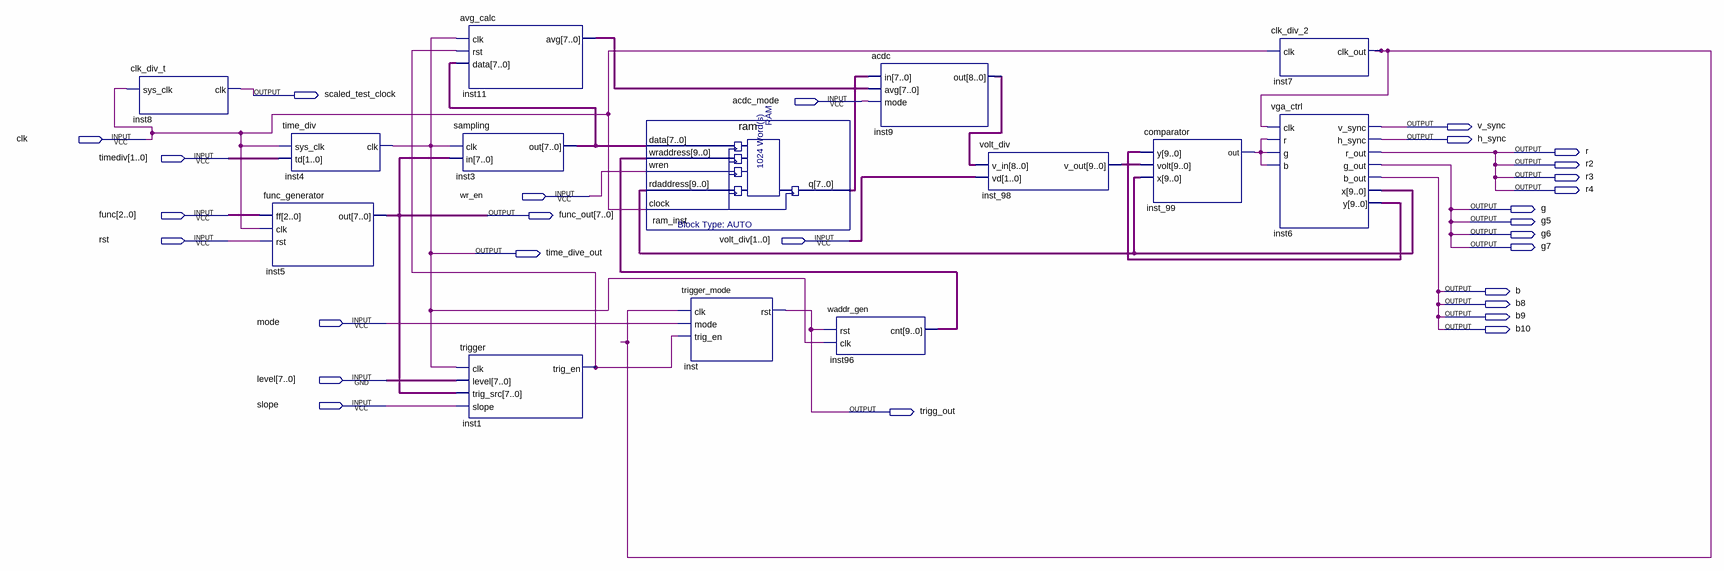
[diagram p0: schematic sheet]
// Quartus schematic ex5.bdf as structural Verilog: 14 symbols, 28 pins
module ex5 (
  input  acdc_mode,
  input  clk,
  input  [1:0] timediv,
  input  wr_en,
  input  [2:0] func,
  input  rst,
  input  [1:0] volt_div,
  input  mode,
  input  [7:0] level,
  input  slope,
  output scaled_test_clock,
  output v_sync,
  output h_sync,
  output r,
  output r2,
  output r3,
  output r4,
  output g,
  output [7:0] func_out,
  output g5,
  output g6,
  output g7,
  output time_dive_out,
  output b,
  output b8,
  output b9,
  output b10,
  output trigg_out
);

  wire inst1_trig_en, inst7_clk_out, inst_99_out;
  wire [7:0] inst3_out, inst11_avg, ram_inst_q;
  wire [8:0] inst9_out;
  wire [9:0] inst6_x, inst6_y, inst96_cnt, inst_98_v_out;

  clk_div_t inst8 (.sys_clk(clk), .clk(scaled_test_clock));
  time_div inst4 (.sys_clk(clk), .td(timediv), .clk(time_dive_out));
  func_generator inst5 (.ff(func), .clk(clk), .rst(rst), .out(func_out));
  sampling inst3 (.clk(time_dive_out), .in(func_out), .out(inst3_out));
  avg_calc inst11 (.clk(time_dive_out), .rst(inst1_trig_en), .data(inst3_out), .avg(inst11_avg));
  trigger inst1 (.clk(time_dive_out), .level(level), .trig_src(func_out), .slope(slope), .trig_en(inst1_trig_en));
  ram ram_inst (
    .data(inst3_out), .wraddress(inst96_cnt), .wren(wr_en), .rdaddress(inst6_x), .clock(clk), .q(ram_inst_q));
  trigger_mode inst (.clk(inst7_clk_out), .mode(mode), .trig_en(inst1_trig_en), .rst(trigg_out));
  waddr_gen inst96 (.rst(trigg_out), .clk(time_dive_out), .cnt(inst96_cnt));
  acdc inst9 (.in(ram_inst_q), .avg(inst11_avg), .mode(acdc_mode), .out(inst9_out));
  volt_div inst_98 (.v_in(inst9_out), .vd(volt_div), .v_out(inst_98_v_out));
  comparator inst_99 (.y(inst6_y), .volt(inst_98_v_out), .x(inst6_x), .out(inst_99_out));
  clk_div_2 inst7 (.clk(clk), .clk_out(inst7_clk_out));
  vga_ctrl inst6 (
    .clk(inst7_clk_out), .r(inst_99_out), .g(inst_99_out), .b(inst_99_out), .v_sync(v_sync), .h_sync(h_sync),
    .r_out(r), .g_out(g), .b_out(b), .x(inst6_x), .y(inst6_y));

  assign b8 = b;
  assign b9 = b;
  assign b10 = b;
  assign g5 = g;
  assign g6 = g;
  assign g7 = g;
  assign r2 = r;
  assign r3 = r;
  assign r4 = r;
endmodule
